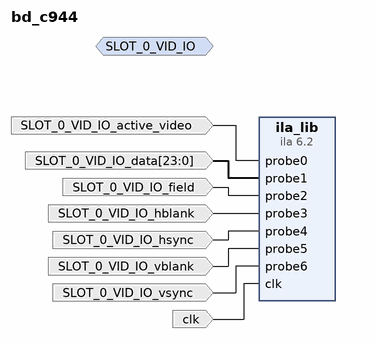
[diagram p0: block diagram of the top level]
# Vivado block design bd_c944, xc7z020clg400-1, Vivado 2023.2
create_bd_design bd_c944

create_bd_intf_port -mode Monitor -vlnv xilinx.com:interface:vid_io_rtl:1.0 SLOT_0_VID_IO
create_bd_port -dir I -type clk clk
create_bd_port -dir I SLOT_0_VID_IO_active_video
create_bd_port -dir I -from 23 -to 0 SLOT_0_VID_IO_data
create_bd_port -dir I SLOT_0_VID_IO_field
create_bd_port -dir I SLOT_0_VID_IO_hblank
create_bd_port -dir I SLOT_0_VID_IO_hsync
create_bd_port -dir I SLOT_0_VID_IO_vblank
create_bd_port -dir I SLOT_0_VID_IO_vsync

create_bd_cell -type ip -vlnv xilinx.com:ip:ila:6.2 ila_lib
set_property -dict [list \
  CONFIG.ALL_PROBE_SAME_MU TRUE \
  CONFIG.ALL_PROBE_SAME_MU_CNT 1 \
  CONFIG.C_ADV_TRIGGER FALSE \
  CONFIG.C_DATA_DEPTH 1024 \
  CONFIG.C_EN_STRG_QUAL 0 \
  CONFIG.C_ILA_CLK_FREQ 74250000 \
  CONFIG.C_INPUT_PIPE_STAGES 0 \
  CONFIG.C_MONITOR_TYPE Native \
  CONFIG.C_NUM_OF_PROBES 7 \
  CONFIG.C_PROBE0_TYPE 0 \
  CONFIG.C_PROBE0_WIDTH 1 \
  CONFIG.C_PROBE1_TYPE 0 \
  CONFIG.C_PROBE1_WIDTH 24 \
  CONFIG.C_PROBE2_TYPE 0 \
  CONFIG.C_PROBE2_WIDTH 1 \
  CONFIG.C_PROBE3_TYPE 0 \
  CONFIG.C_PROBE3_WIDTH 1 \
  CONFIG.C_PROBE4_TYPE 0 \
  CONFIG.C_PROBE4_WIDTH 1 \
  CONFIG.C_PROBE5_TYPE 0 \
  CONFIG.C_PROBE5_WIDTH 1 \
  CONFIG.C_PROBE6_TYPE 0 \
  CONFIG.C_PROBE6_WIDTH 1 \
  CONFIG.C_TRIGIN_EN false \
  CONFIG.C_TRIGOUT_EN false \
  CONFIG.C_XLNX_HW_PROBE_INFO DEFAULT \
] [get_bd_cells ila_lib]

# ---- connections ----

connect_bd_net [get_bd_ports SLOT_0_VID_IO_active_video] [get_bd_pins ila_lib/probe0]
connect_bd_net [get_bd_ports SLOT_0_VID_IO_data] [get_bd_pins ila_lib/probe1]
connect_bd_net [get_bd_ports SLOT_0_VID_IO_field] [get_bd_pins ila_lib/probe2]
connect_bd_net [get_bd_ports SLOT_0_VID_IO_hblank] [get_bd_pins ila_lib/probe3]
connect_bd_net [get_bd_ports SLOT_0_VID_IO_hsync] [get_bd_pins ila_lib/probe4]
connect_bd_net [get_bd_ports SLOT_0_VID_IO_vblank] [get_bd_pins ila_lib/probe5]
connect_bd_net [get_bd_ports SLOT_0_VID_IO_vsync] [get_bd_pins ila_lib/probe6]
connect_bd_net [get_bd_ports clk] [get_bd_pins ila_lib/clk]

validate_bd_design
save_bd_design
